# EAGLE design x-OSC Gloves_v4 (EAGLE 6.4)
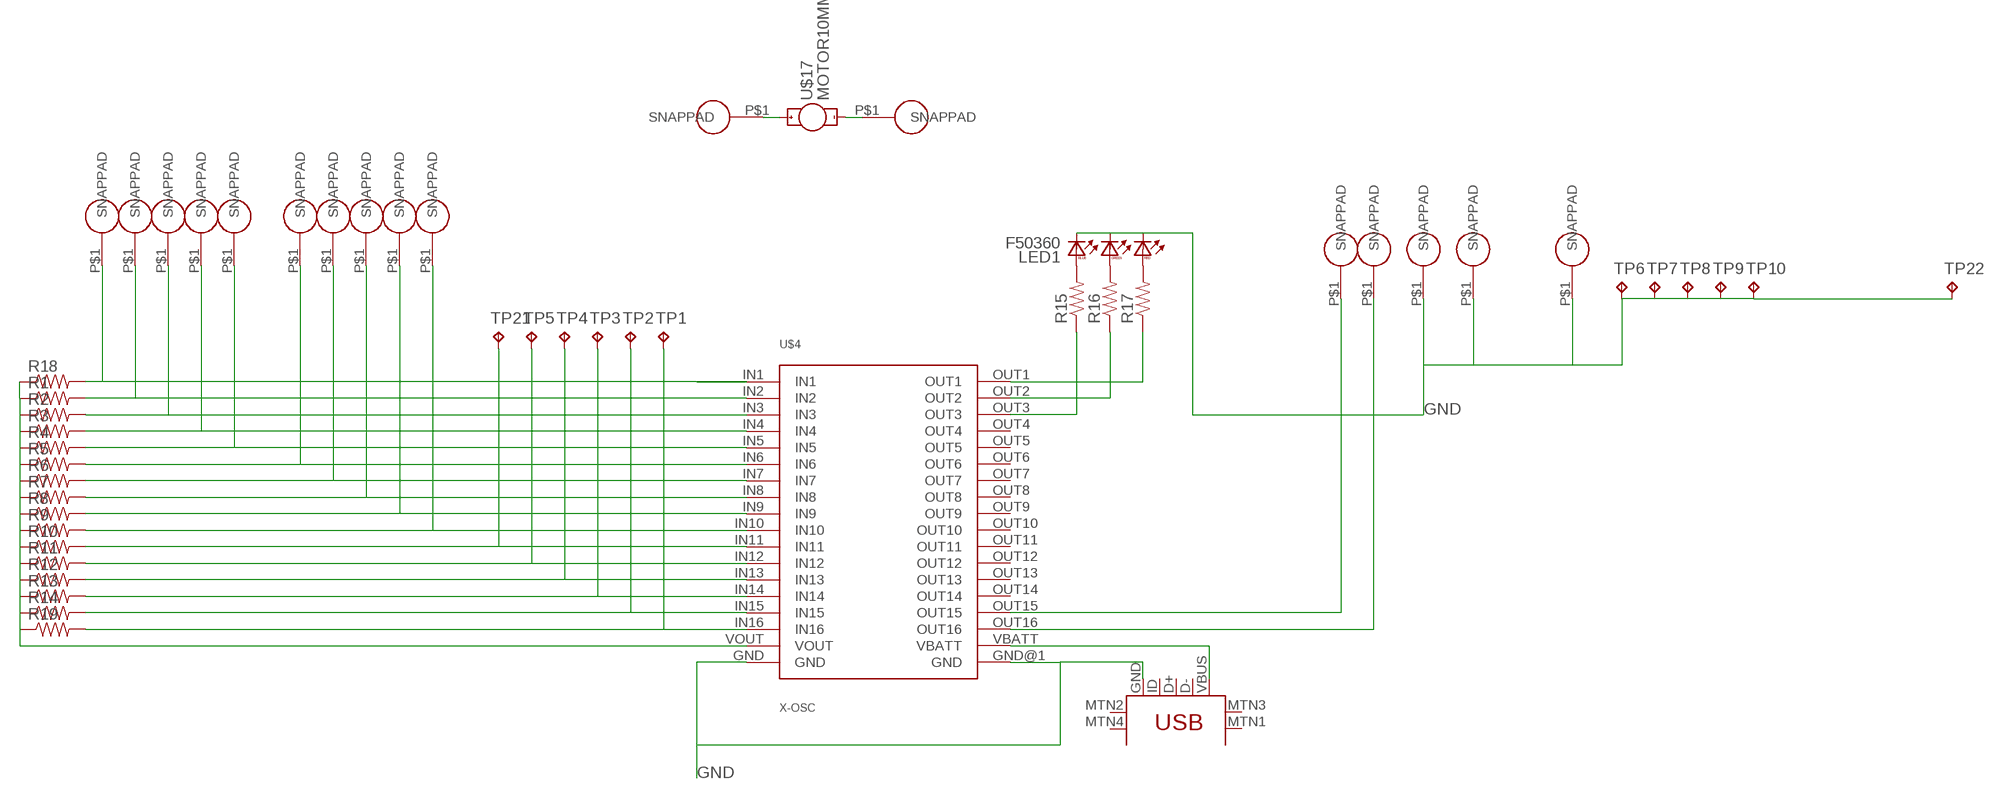
[diagram p0: schematic, sheet 1]

## Parts
LED1  F50360  [F50360]
R1  RESISTOR0805-RES  [0805]
R2  RESISTOR0805-RES  [0805]
R3  RESISTOR0805-RES  [0805]
R4  RESISTOR0805-RES  [0805]
R5  RESISTOR0805-RES  [0805]
R6  RESISTOR0805-RES  [0805]
R7  RESISTOR0805-RES  [0805]
R8  RESISTOR0805-RES  [0805]
R9  RESISTOR0805-RES  [0805]
R10  RESISTOR0805-RES  [0805]
R11  RESISTOR0805-RES  [0805]
R12  RESISTOR0805-RES  [0805]
R13  RESISTOR0805-RES  [0805]
R14  RESISTOR0805-RES  [0805]
R15  RESISTOR0805-RES  [0805]
R16  RESISTOR0805-RES  [0805]
R17  RESISTOR0805-RES  [0805]
R18  RESISTOR0805-RES  [0805]
R19  RESISTOR0805-RES  [0805]
TP1  TPTP20R  [TP20R]
TP2  TPTP20R  [TP20R]
TP3  TPTP20R  [TP20R]
TP4  TPTP20R  [TP20R]
TP5  TPTP20R  [TP20R]
TP6  TPTP20R  [TP20R]
TP7  TPTP20R  [TP20R]
TP8  TPTP20R  [TP20R]
TP9  TPTP20R  [TP20R]
TP10  TPTP20R  [TP20R]
TP21  TPTP20R  [TP20R]
TP22  TPTP20R  [TP20R]
U$1  SNAP-PAD_7MM_ROUND  [SNAP-PAD_7MM_RD]
U$2  SNAP-PAD_7MM_ROUND  [SNAP-PAD_7MM_RD]
U$3  SNAP-PAD_7MM_ROUND  [SNAP-PAD_7MM_RD]
U$4  X-OSC  [X-OSC_SMD]
U$5  USB-MINIB-5PIN  [USB-MINIB]
U$6  SNAP-PAD_7MM_ROUND  [SNAP-PAD_7MM_RD]
U$7  SNAP-PAD_7MM_ROUND  [SNAP-PAD_7MM_RD]
U$8  SNAP-PAD_7MM_ROUND  [SNAP-PAD_7MM_RD]
U$9  SNAP-PAD_7MM_ROUND  [SNAP-PAD_7MM_RD]
U$10  SNAP-PAD_7MM_ROUND  [SNAP-PAD_7MM_RD]
U$11  SNAP-PAD_7MM_ROUND  [SNAP-PAD_7MM_RD]
U$13  SNAP-PAD_7MM_ROUND  [SNAP-PAD_7MM_RD]
U$14  SNAP-PAD_7MM_ROUND  [SNAP-PAD_7MM_RD]
U$15  SNAP-PAD_7MM_ROUND  [SNAP-PAD_7MM_RD]
U$16  SNAP-PAD_7MM_ROUND  [SNAP-PAD_7MM_RD]
U$17  MOTOR10MM  [VIBE-MOTOR-10MM]
U$18  SNAP-PAD_7MM_ROUND  [SNAP-PAD_7MM_RD]
U$19  SNAP-PAD_7MM_ROUND  [SNAP-PAD_7MM_RD]
U$20  SNAP-PAD_7MM_ROUND  [SNAP-PAD_7MM_RD]
U$21  SNAP-PAD_7MM_ROUND  [SNAP-PAD_7MM_RD]

## Nets
GND: LED1.BC LED1.GC LED1.RC TP6.TP TP7.TP TP8.TP TP9.TP TP10.TP TP22.TP U$4.GND U$4.GND@1(GND) U$5.GND U$15.P$1(SNAPPAD) U$16.P$1(SNAPPAD) U$18.P$1(SNAPPAD)
N$1: LED1.BA R15.2
N$2: LED1.GA R16.2
N$3: R15.1 U$4.OUT3
N$4: R1.2 U$1.P$1(SNAPPAD) U$4.IN2
N$5: R16.1 U$4.OUT2
N$6: R2.2 U$2.P$1(SNAPPAD) U$4.IN3
N$7: R3.2 U$3.P$1(SNAPPAD) U$4.IN4
N$8: R4.2 U$4.IN5 U$6.P$1(SNAPPAD)
N$9: R5.2 U$4.IN6 U$7.P$1(SNAPPAD)
N$12: R6.2 U$4.IN7 U$8.P$1(SNAPPAD)
N$13: R7.2 U$4.IN8 U$9.P$1(SNAPPAD)
N$14: R8.2 U$4.IN9 U$10.P$1(SNAPPAD)
N$15: R9.2 U$4.IN10 U$11.P$1(SNAPPAD)
N$16: R10.2 TP21.TP U$4.IN11
N$17: LED1.RA R17.2
N$18: R11.2 TP5.TP U$4.IN12
N$19: R12.2 TP4.TP U$4.IN13
N$20: R13.2 TP3.TP U$4.IN14
N$21: R14.2 TP2.TP U$4.IN15
N$22: R19.2 TP1.TP U$4.IN16
N$23: U$4.OUT15 U$13.P$1(SNAPPAD)
N$24: U$4.OUT16 U$14.P$1(SNAPPAD)
N$25: R17.1 U$4.OUT1
N$33: U$4.VBATT U$5.VBUS
N$38: U$17.+ U$19.P$1(SNAPPAD)
N$40: R18.2 U$4.IN1 U$21.P$1(SNAPPAD)
N$46: U$17.- U$20.P$1(SNAPPAD)
VDD: R1.1 R2.1 R3.1 R4.1 R5.1 R6.1 R7.1 R8.1 R9.1 R10.1 R11.1 R12.1 R13.1 R14.1 R18.1 R19.1 U$4.VOUT
Unconnected: U$4.OUT4 U$4.OUT5 U$4.OUT6 U$4.OUT7 U$4.OUT8 U$4.OUT9 U$4.OUT10 U$4.OUT11 U$4.OUT12 U$4.OUT13 U$4.OUT14 U$5.D+ U$5.D- U$5.ID U$5.MTN1(MTN2) U$5.MTN2(MTN3) U$5.MTN3(MTN1) U$5.MTN4

## Library data of the parts
LED1 = led:F50360: Full color Z-Power LED RGB P5-II Series Source: http://www.seoulsemicon.co.kr .. F50360.pdf
R1-R19 = SparkFun-Passives:RESISTOR: Resistor Basic schematic elements and footprints for 0603, 1206, and PTH resistors.
TP1-TP10 TP21 TP22 = testpad:TP: Test pad
U$1-U$3 U$6-U$11 U$13-U$16 U$18-U$21 = hannahsEagleLib:SNAP-PAD_7MM_ROUND
U$4 = x-io:X-OSC: 2x "TSM-118-04-F-SV" See: http://www.toby.co.uk/content/catalogue/products.aspx?series=TSM-1xx-xx-SV
U$5 = SparkFun-Connectors:USB-MINIB: Mini-USB "B" connector with 5th pin broken out. Created new symbol breaking out 5th "ID" pin in mini/micro USB connector spec. See: http://en.wikipedia.org/wiki/Mini_usb#Cables. Uses same footprint as 4-pin symbol. Also added pins to connect to mounting / shield pads if required (probably not generally needed as signals aren't shielded once they leave the connector).
U$17 = SparkFun-Electromechanical:MOTOR: Vibration Motor- ROB-08449 Physical dimension and wire connections for this powerful vibration motor. Motor has a self adhesive backing.

## Board
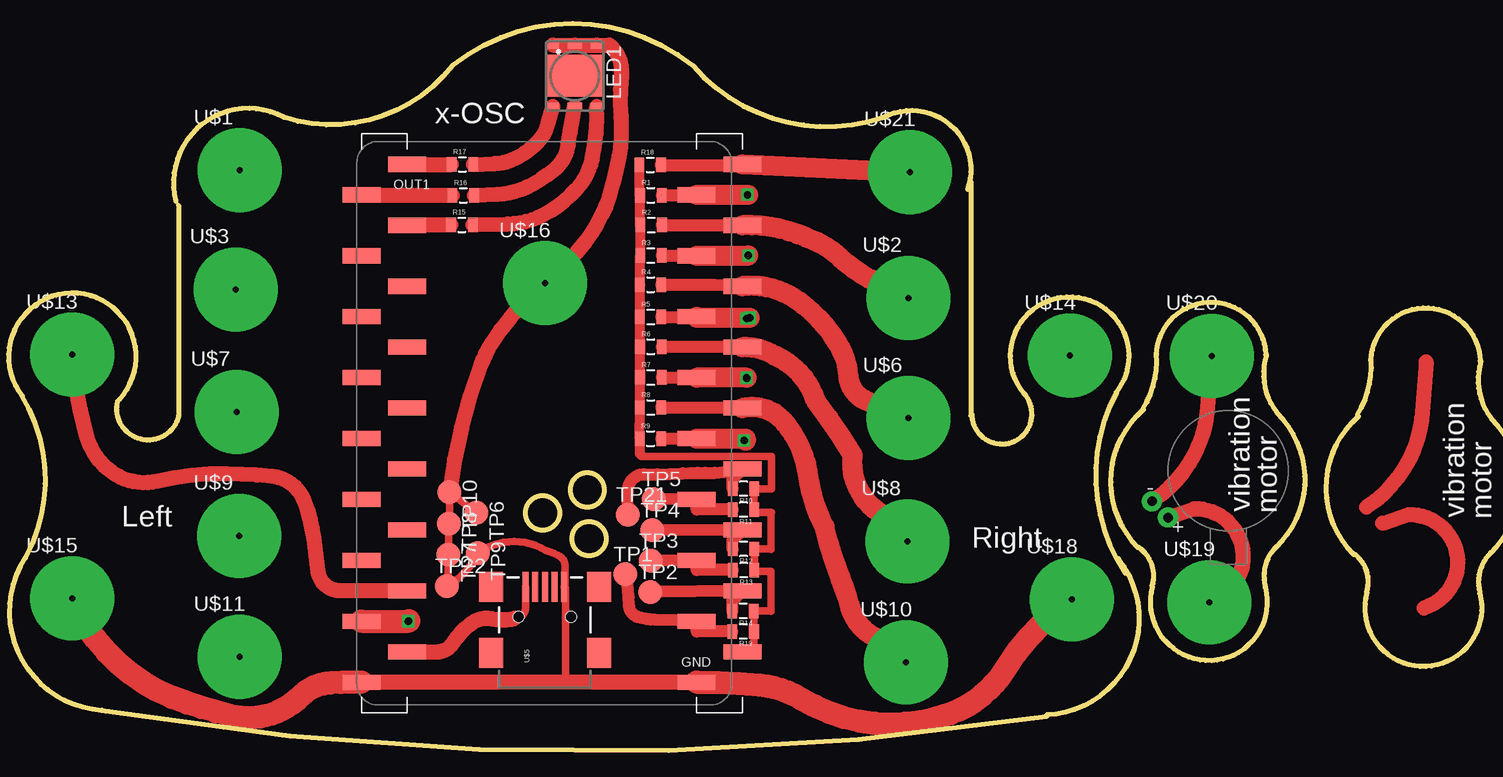
[diagram p1: board, top side]
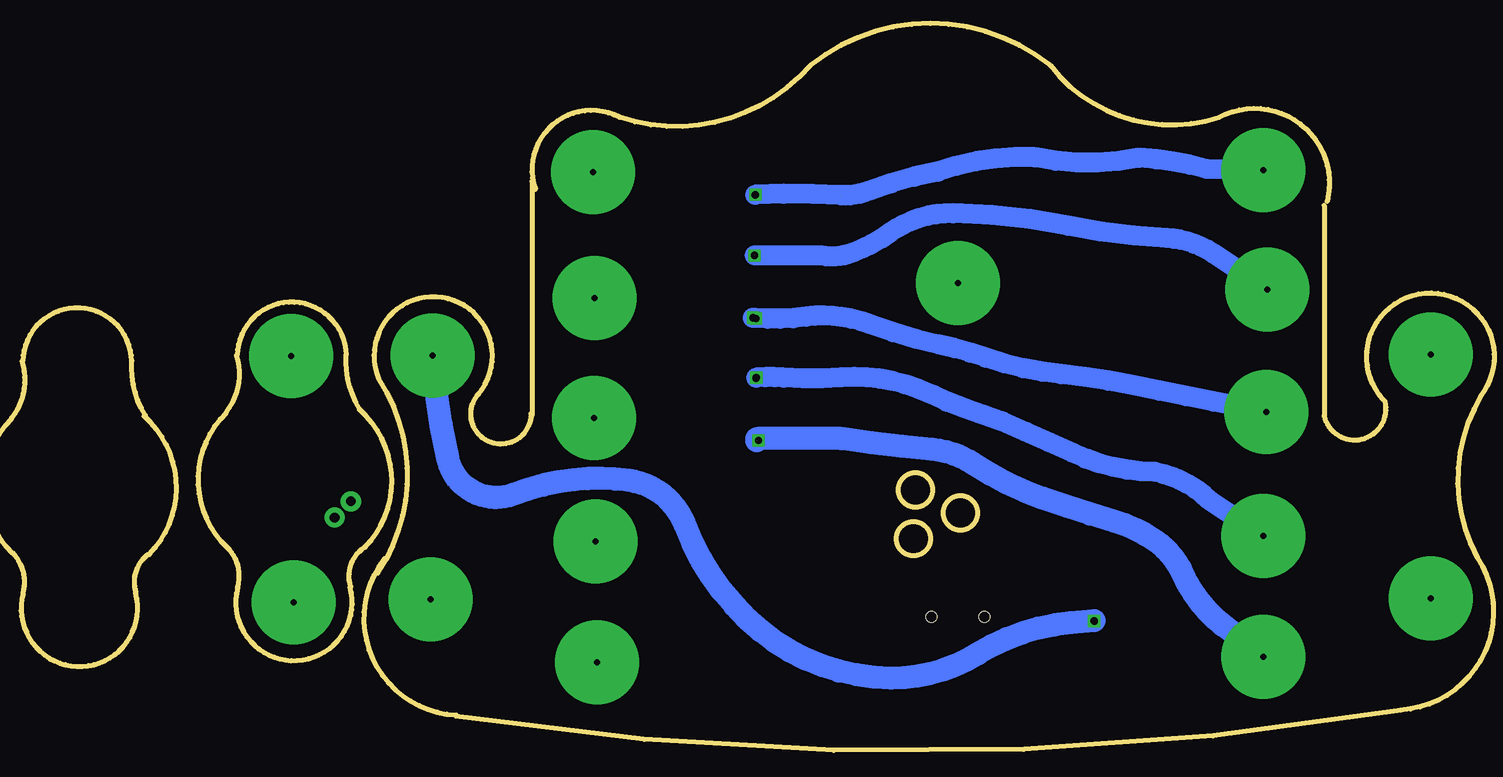
[diagram p2: board, bottom side, seen from below]

No outline drawn. Coordinates in mm, seen from the top.
Copper layers (1*16): Top 0.035mm / dielectric 1.5mm / Bottom 0.035mm
Design rules "default": minimum track width 10mil, minimum drill 24mil, track to track 8mil, track to pad 8mil, pad to pad 8mil, via to via 8mil, smd to smd 8mil, copper to edge 40mil, drill to drill 8mil, minimum pad ring 10mil, minimum via ring 8mil, stop-mask expansion 4mil, vias tented up to drill 0mil, thermal gap 10mil
Milling: area 48.1,12.5 to 50.9,15.3; area 44.2,14.6 to 47,17.4; area 47.9,16.5 to 50.7,19.3; 32 lines

### Footprints (pad centres in the part's own frame; a part is rotated, then mirrored left to right if it is on the bottom)
F50360 = smd 0.6 x 1.05: BA 2.55,1.825; BC -2.55,1.825; RA 2.55,-1.825; RC -2.55,-1.825 | smd 0.6 x 1.2: GA 2.55,0; GC -2.55,0 | smd 3.5 x 4.7: NC 0,0
0805 = smd 0.8 x 1.2: 1 -0.9,0; 2 0.9,0
TP20R = smd 2 x 2: TP 0,0
SNAP-PAD_7MM_RD = drill 0.5 pad 7: P$1 0,0
X-OSC_SMD = smd 3.17 x 1.27: GND 12.7,-21.59; GND@1 -15.24,-21.59; IN1 16.51,21.59; IN2 12.7,19.05; IN3 16.51,16.51; IN4 12.7,13.97; IN5 16.51,11.43; IN6 12.7,8.89; IN7 16.51,6.35; IN8 12.7,3.81; IN9 16.51,1.27; IN10 12.7,-1.27; IN11 16.51,-3.81; IN12 12.7,-6.35; IN13 16.51,-8.89; IN14 12.7,-11.43; IN15 16.51,-13.97; IN16 12.7,-16.51; OUT1 -11.43,21.59; OUT2 -15.24,19.05; OUT3 -11.43,16.51; OUT4 -15.24,13.97; OUT5 -11.43,11.43; OUT6 -15.24,8.89; OUT7 -11.43,6.35; OUT8 -15.24,3.81; OUT9 -11.43,1.27; OUT10 -15.24,-1.27; OUT11 -11.43,-3.81; OUT12 -15.24,-6.35; OUT13 -11.43,-8.89; OUT14 -15.24,-11.43; OUT15 -11.43,-13.97; OUT16 -15.24,-16.51; VBATT -11.43,-19.05; VOUT 16.51,-19.05
USB-MINIB = smd 2.5 x 0.5: D+ 2.5,0; D- 2.5,0.8; GND 2.5,-1.6; ID 2.5,-0.8; VBUS 2.5,1.6 | smd 2.5 x 2: MTN1 -3,4.5; MTN2 2.5,4.5; MTN3 -3,-4.5; MTN4 2.5,-4.5 | hole 0.9: 0,2.2; 0,-2.2
VIBE-MOTOR-10MM = drill 0.8 pad 1.676: + -5,-3.9; - -6.35,-2.54

### Placement (x,y rotation side)
LED1  48.26,52.47 270 top
R1  54.6,42.51 0 top
R2  54.63,40.03 0 top
R3  54.61,37.49 0 top
R4  54.59,35.06 0 top
R5  54.59,32.37 0 top
R6  54.6,29.88 0 top
R7  54.6,27.32 0 top
R8  54.59,24.81 0 top
R9  54.57,22.21 0 top
R10  62.33,18.04 180 top
R11  62.32,16.29 180 top
R12  62.33,13.02 180 top
R13  62.34,11.25 180 top
R14  62.3,7.84 180 top
R15  38.85,40.04 0 top
R16  38.97,42.5 0 top
R17  38.89,45.08 0 top
R18  54.55,45.04 0 top
R19  62.31,6.14 180 top
TP1  52.48,10.91 0 top
TP2  54.55,9.43 0 top
TP3  54.61,12.03 0 top
TP4  54.73,14.57 0 top
TP5  54.84,17.17 0 top
TP6  40.06,16.02 270 top
TP7  37.71,12.53 270 top
TP8  37.76,15.12 270 top
TP9  40.18,12.65 270 top
TP10  37.81,17.77 270 top
TP21  52.69,15.88 0 top
TP22  37.6,9.93 0 top
U$1  20.31,44.59 0 top
U$2  76.06,33.96 0 top
U$3  19.98,34.66 0 top
U$4  45.72,23.5 0 top
U$5  45.77,7.35 90 top
U$6  76.09,23.92 0 top
U$7  20.07,24.45 0 top
U$8  75.98,13.65 0 top
U$9  20.31,14.12 0 top
U$10  75.87,3.55 0 top
U$11  20.32,4.02 0 top
U$13  6.35,29.21 0 top
U$14  89.56,29.13 0 top
U$15  6.35,8.89 0 top
U$16  45.78,35.17 0 top
U$17  102.73,19.53 0 top
U$18  89.72,8.81 0 top
U$19  101.16,8.58 0 top
U$20  101.36,29.12 0 top
U$21  76.2,44.45 0 top

### Tracks (layer width: path | path; a pad name or v marks a point on that pad's centre or on a via)
GND
  Top 0.61: 47.48,1.91 47.48,9.75 arc90 U$5.GND 47.44,9.85 47.44,11.63 arc66 46.88,12.49 arc5 45.84,12.89 arc67 TP9.TP arc-37 TP22.TP 37.71,9.94 TP7.TP 37.76,12.53 TP8.TP 37.81,15.12 TP10.TP TP6.TP
  Top 1.27: LED1.BC LED1.GC LED1.RC 51.16,55.02 51.18,54.99 arc-5 51.62,54.51 arc-21 51.98,53.87 arc-24 52.14,52.47 arc10 52.1,48.99 arc-14 51.94,45.75 arc-7 51.14,42.48 arc-20 49.15,38.63 arc-13 U$16.P$1 arc18 41.31,30.16 arc12 40.42,28.36 arc13 TP10.TP | U$4.GND 47.48,1.91 U$4.GND@1
  Top 1.93: U$4.GND arc-5 63.65,1.67 arc-26 67.16,0.52 arc51 79.59,-0.69 arc38 84.19,3.05 arc-24 U$18.P$1 | U$4.GND@1 arc3 27.91,1.84 arc42 25.44,0.75 arc-22 23.48,-0.58 arc-38 19.51,-0.86 arc-3 15.94,0.17 arc-49 U$15.P$1
N$1
  Top 1.27: R15.2 42.67,40.12 arc26 45.63,40.88 arc21 48.43,43.03 arc29 49.71,45.51 arc15 LED1.BA
N$2
  Top 1.27: R16.2 41.82,42.58 arc23 44.27,43.19 arc14 46.55,44.63 arc43 47.71,46.67 arc-3 LED1.GA
N$3
  Top 1.27: U$4.OUT3 34.29,40.04 R15.1
N$4  (1 unrouted)
  Top 1.016: R1.2 58.42,42.51 U$4.IN2
  Top 1.676: U$4.IN2 62.73,42.55 | 62.73,42.55
  Bottom 1.676: U$1.P$1 25.03,44.7 arc-12 30.66,45.62 arc23 39.35,45.68 arc-22 47.48,44.47 arc-11 53.23,42.86 arc25 R1.2 arc-7 62.67,42.55
N$5
  Top 1.27: U$4.OUT2 30.48,42.5 R16.1
N$6
  Top 1.016: R2.2 62.23,40.03 U$4.IN3
  Top 1.676: U$2.P$1 76,33.9 72.82,35.56 arc-16 70.4,37.29 arc20 68.33,38.67 arc7 66.12,39.5 arc20 U$4.IN3
N$7  (1 unrouted)
  Top 1.016: R3.2 58.42,37.49 U$4.IN4
  Top 1.676: U$4.IN4 62.68,37.47 62.72,37.51 | 62.72,37.51 | 62.72,37.51 62.69,37.48
  Bottom 1.676: U$3.P$1 24.52,37.67 arc-31 28.37,38.94 arc9 36.6,39.98 arc-11 46.16,41.01 arc-36 51.51,39.34 arc14 54.5,37.73 arc32 57.15,37.49 62.72,37.49 62.72,37.51
N$8
  Top 1.016: R4.2 59.88,35.06 U$4.IN5
  Top 1.676: U$6.P$1 72.54,25.39 arc-63 71.09,27.39 arc27 70.19,30.16 arc20 67.36,33.34 arc25 64.74,34.73 arc21 U$4.IN5
N$9  (via drill 0.6)
  Top 1.016: R5.2 58.42,32.37 U$4.IN6
  Top 1.676: v62.86,32.29 58.42,32.29 U$4.IN6
  Bottom 1.676: U$7.P$1 24.45,25.3 arc1 31.29,26.69 arc-6 37.16,27.59 arc14 43.45,28.97 arc-7 47.38,30.07 arc8 53.05,31.73 arc-12 R5.2 arc-17 U$4.IN6 arc13 62.72,32.29 arc-11 v62.86,32.29
N$10  (via drill 0.6)
  other vias: 62.66,42.55
N$12
  Top 1.016: R6.2 62.23,29.88 U$4.IN7
  Top 1.676: U$8.P$1 74.41,15.63 arc-74 71.45,20.82 arc5 68.35,25.41 arc48 64.94,29.12 arc33 U$4.IN7
N$13  (via drill 0.6)
  Top 1.016: R7.2 58.42,27.32 U$4.IN8
  Top 1.676: v62.58,27.31 U$4.IN8
  Bottom 1.676: U$9.P$1 24.8,17.08 arc-33 29.36,19.44 arc25 36.19,21.03 arc0 42.1,23.66 arc2 46.69,25.3 arc-12 50.22,26.76 arc-21 R7.2 arc9 60.3,27.31 arc-9 v62.58,27.31
N$14
  Top 1.016: R8.2 62.23,24.81 U$4.IN9
  Top 1.676: U$10.P$1 73.17,5.72 arc-48 71.22,8.23 arc5 70.42,10.61 arc-9 69.08,14.87 arc-20 67.68,19.51 arc27 66.1,23.08 arc72 U$4.IN9
N$15  (1 unrouted)
  Top 1.016: R9.2 58.42,22.21 U$4.IN10
  Top 1.676: U$4.IN10 62.54,22.23 62.54,22.03
  Bottom 1.93: U$11.P$1 23.65,6.63 arc28 26.99,10.89 arc-31 29.35,13.72 arc-18 32.75,15.33 arc3 38.67,17.23 arc15 44.49,20.11 arc-29 47.94,21.32 arc3 R9.2 62.54,22.21 62.54,22.03
N$16
  Top 1.016: U$4.IN11 | R10.2 61.43,18.88 U$4.IN11 | TP21.TP 52.66,17.71 arc-32 52.9,18.59 arc-60 54.06,19.23 arc5 57.26,19.31 arc-5 59.14,19.35 arc15 U$4.IN11
N$17
  Top 1.27: R17.2 41.59,45.15 arc28 43.63,45.75 arc17 45.27,47.07 arc29 46.03,48.47 arc-3 LED1.RA
N$18
  Top 1.016: R11.2 58.42,16.29 U$4.IN12 TP5.TP
N$19
  Top 1.016: R12.2 61.43,13.8 U$4.IN13 TP4.TP
N$20
  Top 1.016: R13.2 58.42,11.25 U$4.IN14 TP3.TP
N$21
  Top 1.016: R14.2 61.4,8.69 U$4.IN15 TP2.TP
N$22
  Top 1.016: R19.2 58.42,6.14 U$4.IN16 58.42,7.04 54.94,7.12 arc-14 53.58,7.32 arc-74 52.78,8.36 arc13 TP1.TP
N$23
  Top 1.27: U$4.OUT15 28.66,9.54 arc-83 26.86,11.13 26.52,13.89 arc15 25.69,17.07 arc62 23,19.08 arc4 19.27,19.28 arc14 13.47,18.66 arc-49 9.67,19.42 arc-39 7.6,22.39 arc-10 U$13.P$1
N$24  (via drill 0.6)
  Top 1.93: U$4.OUT16 34.41,6.99 v34.41,7.03
  Bottom 1.93: v34.41,7.03 36.37,6.86 arc-27 44.14,4.26 arc32 51.33,2.25 arc43 63.3,7.15 arc25 68.54,15.04 arc-61 73.2,18.73 arc-14 77.81,18.79 arc-14 82.81,17.58 arc98 88.28,20.52 arc8 U$14.P$1
N$25
  Top 1.27: U$4.OUT1 R17.1
N$26
  Top 1.27: 115.61,15.15 117.76,15.88 arc-165 119.05,8.1
N$28  (via drill 0.6)
  other vias: 62.73,37.5
N$29
  Top 1.27: 119.24,28.64 118.85,23.9 arc-50 114.26,16.51
N$33
  Top 0.61: 43.28,7.23 arc90 44.17,8.12 U$5.VBUS
  Top 1.27: U$4.VBATT 34.3,4.43 36.82,4.43 arc56 38.02,5.06 arc-6 38.69,5.93 arc-14 39.72,6.86 arc-47 41.35,7.2 arc26 43.28,7.23
N$34  (via drill 0.6)
  other vias: 62.59,32.24
N$38
  Top 1.27: U$17.+ 99.88,16.37 arc-165 U$19.P$1
N$40
  Top 1.016: R18.2 62.23,45.04 U$4.IN1
  Top 1.676: U$4.IN1 U$21.P$1
N$41  (via drill 0.6)
  other vias: 62.59,27.26
N$43  (via drill 0.6)
  other vias: 62.39,22.07
N$46
  Top 1.27: U$20.P$1 100.97,24.38 arc-50 U$17.-
N$47  (via drill 0.6)
  other vias: 34.39,6.98
VDD
  Top 0.61: 53.81,20.83 53.9,20.74 64.63,20.74 64.65,20.72 64.65,18.04 R10.1 R11.1 63.44,16.07 64.65,16.07 64.63,16.05 64.63,12.99 64.61,13.02 R12.1 63.24,13.01 R13.1 63.33,11.16 64.64,11.16 64.64,7.83 64.62,7.84 R14.1 R19.1 63.21,4.45 U$4.VOUT
  Top 0.813: R18.1 53.65,42.51 R1.1 53.7,40.03 R2.1 53.73,37.49 R3.1 53.71,35.06 R4.1 R5.1 53.69,29.88 R6.1 R7.1 R8.1 R9.1 53.67,20.97 53.81,20.83

### Text on the board
_tsilk: x-OSC | vibration | motor | vibration | motor | Left | Right